# Altium project bienTroEncoder.PrjPcb
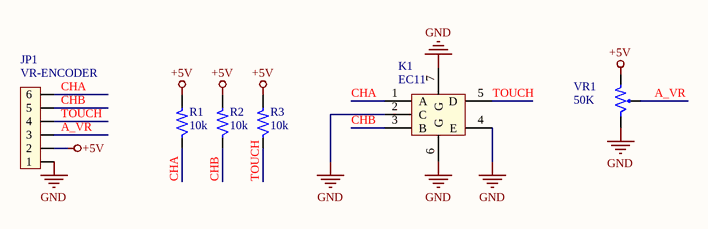
[diagram p0: bienTroEncoder.SchDoc]
1 sheet, 6 parts. Net scope: global (net labels, ports and power ports of the same name join across sheets).
Board file: bienTroEncoder.PcbDoc

## Sheet bienTroEncoder.SchDoc
size A4

### Parts
JP1  VR-ENCODER  [JP6]
K1  EC11
R1  10k  [R-0805]
R2  10k  [R-0805]
R3  10k  [R-0805]
VR1  50K

### Nets
+5V: JP1.2 R1.2 R2.2 R3.2 VR1.1
GND: JP1.1 K1.2(C) K1.4(E) K1.6(G) K1.7(G) VR1.3
A_VR: JP1.3 VR1.2
CHA: JP1.6 K1.1(A) R1.1
CHB: JP1.5 K1.3(B) R2.1
TOUCH: JP1.4 K1.5(D) R3.1

### Library data of the parts
JP1 = JP6: JP6 PIN; Value: JP7
K1 = EC11-SW: Value: EC11
R1-R3 = R: Resistor 1/4W; Value: R1/4W - 1K
VR1 = VR1: Var Resistor; Value: VR 10K